# Altium schematic sheet Superbot_hbridge_mk2.SchDoc
size A4
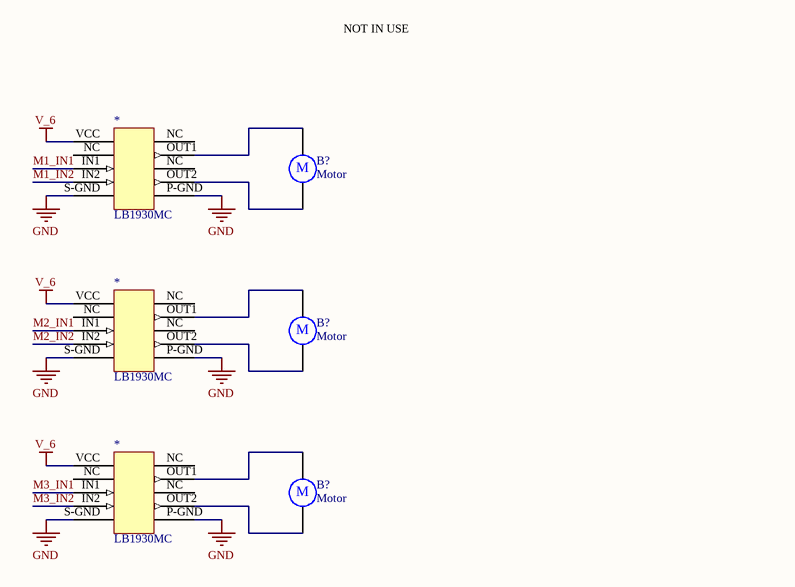
[diagram p0: Superbot_hbridge_mk2.SchDoc]

## Parts
(Parts that share a designator on the sheet are numbered #1, #2 ... from top to bottom, then left to right.)
*#1  LB1930MC
*#2  LB1930MC
*#3  LB1930MC
B?#1  Motor  [RB5-10.5]
B?#2  Motor  [RB5-10.5]
B?#3  Motor  [RB5-10.5]

## Nets
GND: *#1.P-GND *#1.S-GND *#2.P-GND *#2.S-GND *#3.P-GND *#3.S-GND
V_6: *#1.VCC *#2.VCC *#3.VCC
M1_IN1: *#1.IN1
M1_IN2: *#1.IN2
M2_IN1: *#2.IN1
M2_IN2: *#2.IN2
M3_IN1: *#3.IN1
M3_IN2: *#3.IN2
Net*#1_OUT1: *#1.OUT1 B?#1.1
Net*#1_OUT2: *#1.OUT2 B?#1.2
Net*#2_OUT1: *#2.OUT1 B?#2.1
Net*#2_OUT2: *#2.OUT2 B?#2.2
Net*#3_OUT1: *#3.OUT1 B?#3.1
Net*#3_OUT2: *#3.OUT2 B?#3.2

Not connected (* = marked no-connect by the designer): *#1 NC; *#2 NC; *#3 NC

## Notes on the sheet
- NOT IN USE
- (in symbol Motor) M

## Library data of the parts
B?#1-B?#3 = Motor: Motor, General Kind; Published: 24-Mar-1999; LatestRevisionDate: 17-Jul-2002; LatestRevisionNote: Re-released for DXP Platform.; PackageReference: RB5-10.5; Publisher: Altium Limited; PackageDescription: Capacitor (Radial); 2 Leads